# EAGLE design meca_2018 (EAGLE 7.7.0)

## Sheet 1 of 4
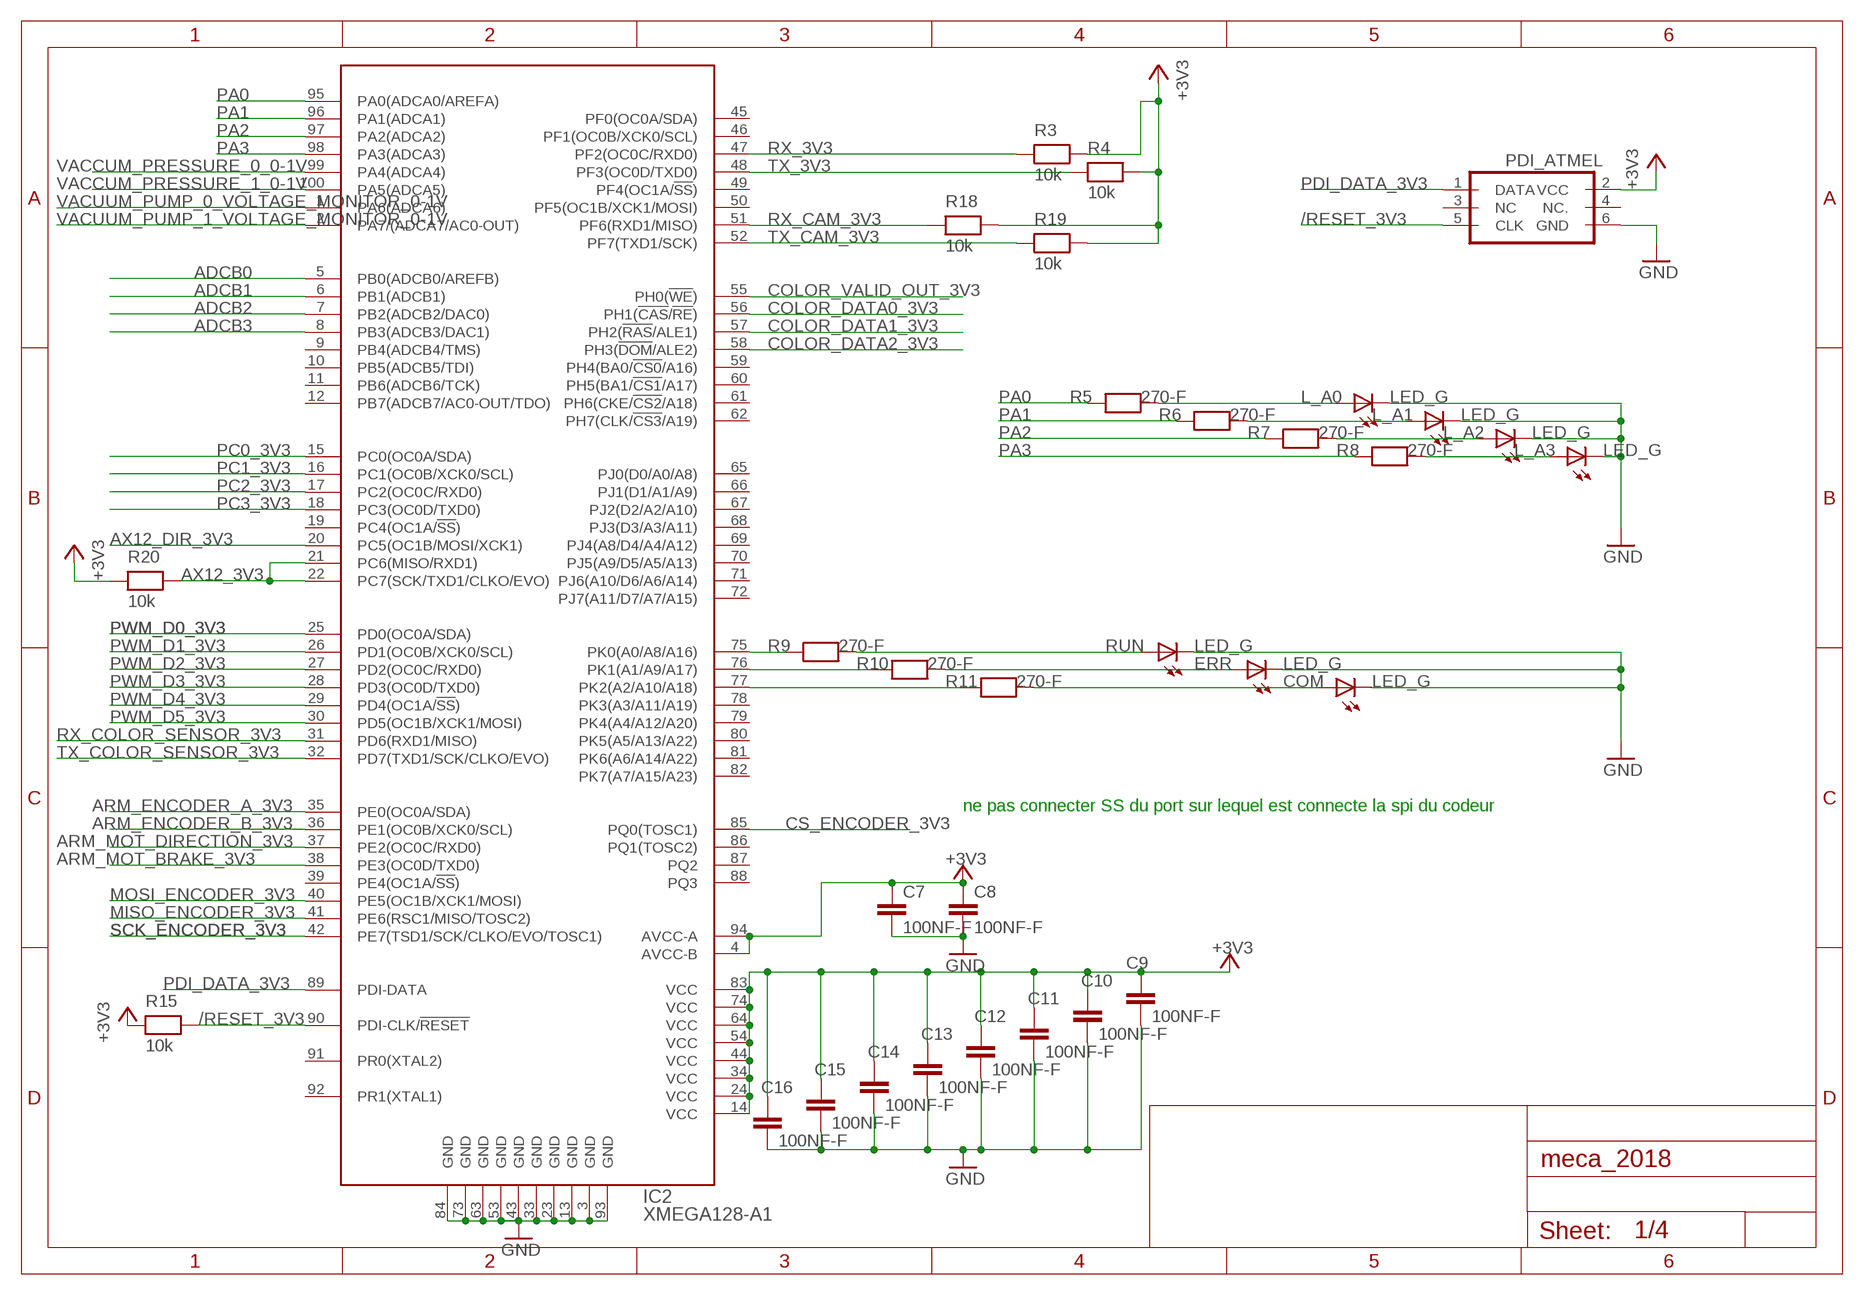
[diagram p0: schematic, sheet 1]

### Parts
C7  100NF-F  [C0603]
C8  100NF-F  [C0603]
C9  100NF-F  [C0603]
C10  100NF-F  [C0603]
C11  100NF-F  [C0603]
C12  100NF-F  [C0603]
C13  100NF-F  [C0603]
C14  100NF-F  [C0603]
C15  100NF-F  [C0603]
C16  100NF-F  [C0603]
COM  LED_G  [CHIP-LED0805]
ERR  LED_G  [CHIP-LED0805]
IC2  XMEGA128-A1  XMEGA-A1TQFP  [TQFP100]
L_A0  LED_G  [CHIP-LED0805]
L_A1  LED_G  [CHIP-LED0805]
L_A2  LED_G  [CHIP-LED0805]
L_A3  LED_G  [CHIP-LED0805]
PDI_ATMEL  PDI_ATMEL  [ML6]
R3  10k  10K-F  [R0603]
R4  10k  10K-F  [R0603]
R5  270-F  [R0603]
R6  270-F  [R0603]
R7  270-F  [R0603]
R8  270-F  [R0603]
R9  270-F  [R0603]
R10  270-F  [R0603]
R11  270-F  [R0603]
R15  10k  10K-F  [R0603]
R18  10k  10K-F  [R0603]
R19  10k  10K-F  [R0603]
R20  10k  10K-F  [R0603]
RUN  LED_G  [CHIP-LED0805]

### Nets
+3V3: C7.1 C8.1 C9.1 C10.1 C11.1 C12.1 C13.1 C14.1 C15.1 C16.1 IC2.4(AVCC-B) IC2.14(VCC) IC2.24(VCC) IC2.34(VCC) IC2.44(VCC) IC2.54(VCC) IC2.64(VCC) IC2.74(VCC) IC2.83(VCC) IC2.94(AVCC-A) PDI_ATMEL.2(VCC) R3.2 R4.2 R15.1 R18.2 R19.2 R20.1 ; also sheet 2,3,4
/RESET_3V3: IC2.90(PDI-CLK/!RESET) PDI_ATMEL.5(CLK) R15.2
ADCB0: IC2.5(PB0(ADCB0/AREFB))
ADCB1: IC2.6(PB1(ADCB1))
ADCB2: IC2.7(PB2(ADCB2/DAC0))
ADCB3: IC2.8(PB3(ADCB3/DAC1))
ARM_ENCODER_A_3V3: IC2.35(PE0(OC0A/SDA))
ARM_ENCODER_B_3V3: IC2.36(PE1(OC0B/XCK0/SCL))
ARM_MOT_BRAKE_3V3: IC2.38(PE3(OC0D/TXD0))
ARM_MOT_DIRECTION_3V3: IC2.37(PE2(OC0C/RXD0))
AX12_3V3: IC2.21(PC6(MISO/RXD1)) IC2.22(PC7(SCK/TXD1/CLKO/EVO)) R20.2 ; also sheet 2
AX12_DIR_3V3: IC2.20(PC5(OC1B/MOSI/XCK1)) ; also sheet 2
COLOR_DATA0_3V3: IC2.56(PH1(!CAS!/!RE!))
COLOR_DATA1_3V3: IC2.57(PH2(!RAS!/ALE1))
COLOR_DATA2_3V3: IC2.58(PH3(!DOM!/ALE2))
COLOR_VALID_OUT_3V3: IC2.55(PH0(!WE!))
CS_ENCODER_3V3: IC2.85(PQ0(TOSC1))
GND: C7.2 C8.2 C9.2 C10.2 C11.2 C12.2 C13.2 C14.2 C15.2 C16.2 COM.C ERR.C IC2.3(GND) IC2.13(GND) IC2.23(GND) IC2.33(GND) IC2.43(GND) IC2.53(GND) IC2.63(GND) IC2.73(GND) IC2.84(GND) IC2.93(GND) L_A0.C L_A1.C L_A2.C L_A3.C PDI_ATMEL.6(GND) RUN.C ; also sheet 2,3,4
MISO_ENCODER_3V3: IC2.41(PE6(RSC1/MISO/TOSC2)) ; also sheet 2
MOSI_ENCODER_3V3: IC2.40(PE5(OC1B/XCK1/MOSI))
N$2: R9.2 RUN.A
N$4: ERR.A R10.2
N$7: COM.A R11.2
N$9: IC2.75(PK0(A0/A8/A16)) R9.1
N$10: IC2.76(PK1(A1/A9/A17)) R10.1
N$12: IC2.77(PK2(A2/A10/A18)) R11.1
N$91: L_A0.A R5.2
N$92: L_A1.A R6.2
N$93: L_A2.A R7.2
N$94: L_A3.A R8.2
PA0: IC2.95(PA0(ADCA0/AREFA)) R5.1
PA1: IC2.96(PA1(ADCA1)) R6.1
PA2: IC2.97(PA2(ADCA2)) R7.1
PA3: IC2.98(PA3(ADCA3)) R8.1
PC0_3V3: IC2.15(PC0(OC0A/SDA))
PC1_3V3: IC2.16(PC1(OC0B/XCK0/SCL))
PC2_3V3: IC2.17(PC2(OC0C/RXD0))
PC3_3V3: IC2.18(PC3(OC0D/TXD0))
PDI_DATA_3V3: IC2.89(PDI-DATA) PDI_ATMEL.1(DATA)
PWM_D0_3V3: IC2.25(PD0(OC0A/SDA)) ; also sheet 2
PWM_D1_3V3: IC2.26(PD1(OC0B/XCK0/SCL)) ; also sheet 2
PWM_D2_3V3: IC2.27(PD2(OC0C/RXD0)) ; also sheet 2
PWM_D3_3V3: IC2.28(PD3(OC0D/TXD0)) ; also sheet 2
PWM_D4_3V3: IC2.29(PD4(OC1A/!SS!)) ; also sheet 2
PWM_D5_3V3: IC2.30(PD5(OC1B/XCK1/MOSI)) ; also sheet 2
RX_3V3: IC2.47(PF2(OC0C/RXD0)) R3.1 ; also sheet 3
RX_CAM_3V3: IC2.51(PF6(RXD1/MISO)) R18.1 ; also sheet 2
RX_COLOR_SENSOR_3V3: IC2.31(PD6(RXD1/MISO))
SCK_ENCODER_3V3: IC2.42(PE7(TSD1/SCK/CLKO/EVO/TOSC1))
TX_3V3: IC2.48(PF3(OC0D/TXD0)) R4.1 ; also sheet 3
TX_CAM_3V3: IC2.52(PF7(TXD1/SCK)) R19.1 ; also sheet 2
TX_COLOR_SENSOR_3V3: IC2.32(PD7(TXD1/SCK/CLKO/EVO))
VACCUM_PRESSURE_0_0-1V: IC2.99(PA4(ADCA4))
VACCUM_PRESSURE_1_0-1V: IC2.100(PA5(ADCA5))
VACUUM_PUMP_0_VOLTAGE_MONITOR_0-1V: IC2.1(PA6(ADCA6))
VACUUM_PUMP_1_VOLTAGE_MONITOR_0-1V: IC2.2(PA7/(ADCA7/AC0-OUT))
Unconnected: IC2.9(PB4(ADCB4/TMS)) IC2.10(PB5(ADCB5/TDI)) IC2.11(PB6(ADCB6/TCK)) IC2.12(PB7(ADCB7/AC0-OUT/TDO)) IC2.19(PC4(OC1A/!SS!)) IC2.39(PE4(OC1A/!SS!)) IC2.45(PF0(OC0A/SDA)) IC2.46(PF1(OC0B/XCK0/SCL)) IC2.49(PF4(OC1A/!SS!)) IC2.50(PF5(OC1B/XCK1/MOSI)) IC2.59(PH4(BA0/!CS0!/A16)) IC2.60(PH5(BA1/!CS1!/A17)) IC2.61(PH6(CKE/!CS2!/A18)) IC2.62(PH7(CLK/!CS3!/A19)) IC2.65(PJ0(D0/A0/A8)) IC2.66(PJ1(D1/A1/A9)) IC2.67(PJ2(D2/A2/A10)) IC2.68(PJ3(D3/A3/A11)) IC2.69(PJ4(A8/D4/A4/A12)) IC2.70(PJ5(A9/D5/A5/A13)) IC2.71(PJ6(A10/D6/A6/A14)) IC2.72(PJ7(A11/D7/A7/A15)) IC2.78(PK3(A3/A11/A19)) IC2.79(PK4(A4/A12/A20)) IC2.80(PK5(A5/A13/A22)) IC2.81(PK6(A6/A14/A22)) IC2.82(PK7(A7/A15/A23)) IC2.86(PQ1(TOSC2)) IC2.87(PQ2) IC2.88(PQ3) IC2.91(PR0(XTAL2)) IC2.92(PR1(XTAL1)) PDI_ATMEL.3(NC) PDI_ATMEL.4(NC.)

### Notes on the sheet
- ne pas connecter SS du port sur lequel est connecte la spi du codeur

## Sheet 2 of 4
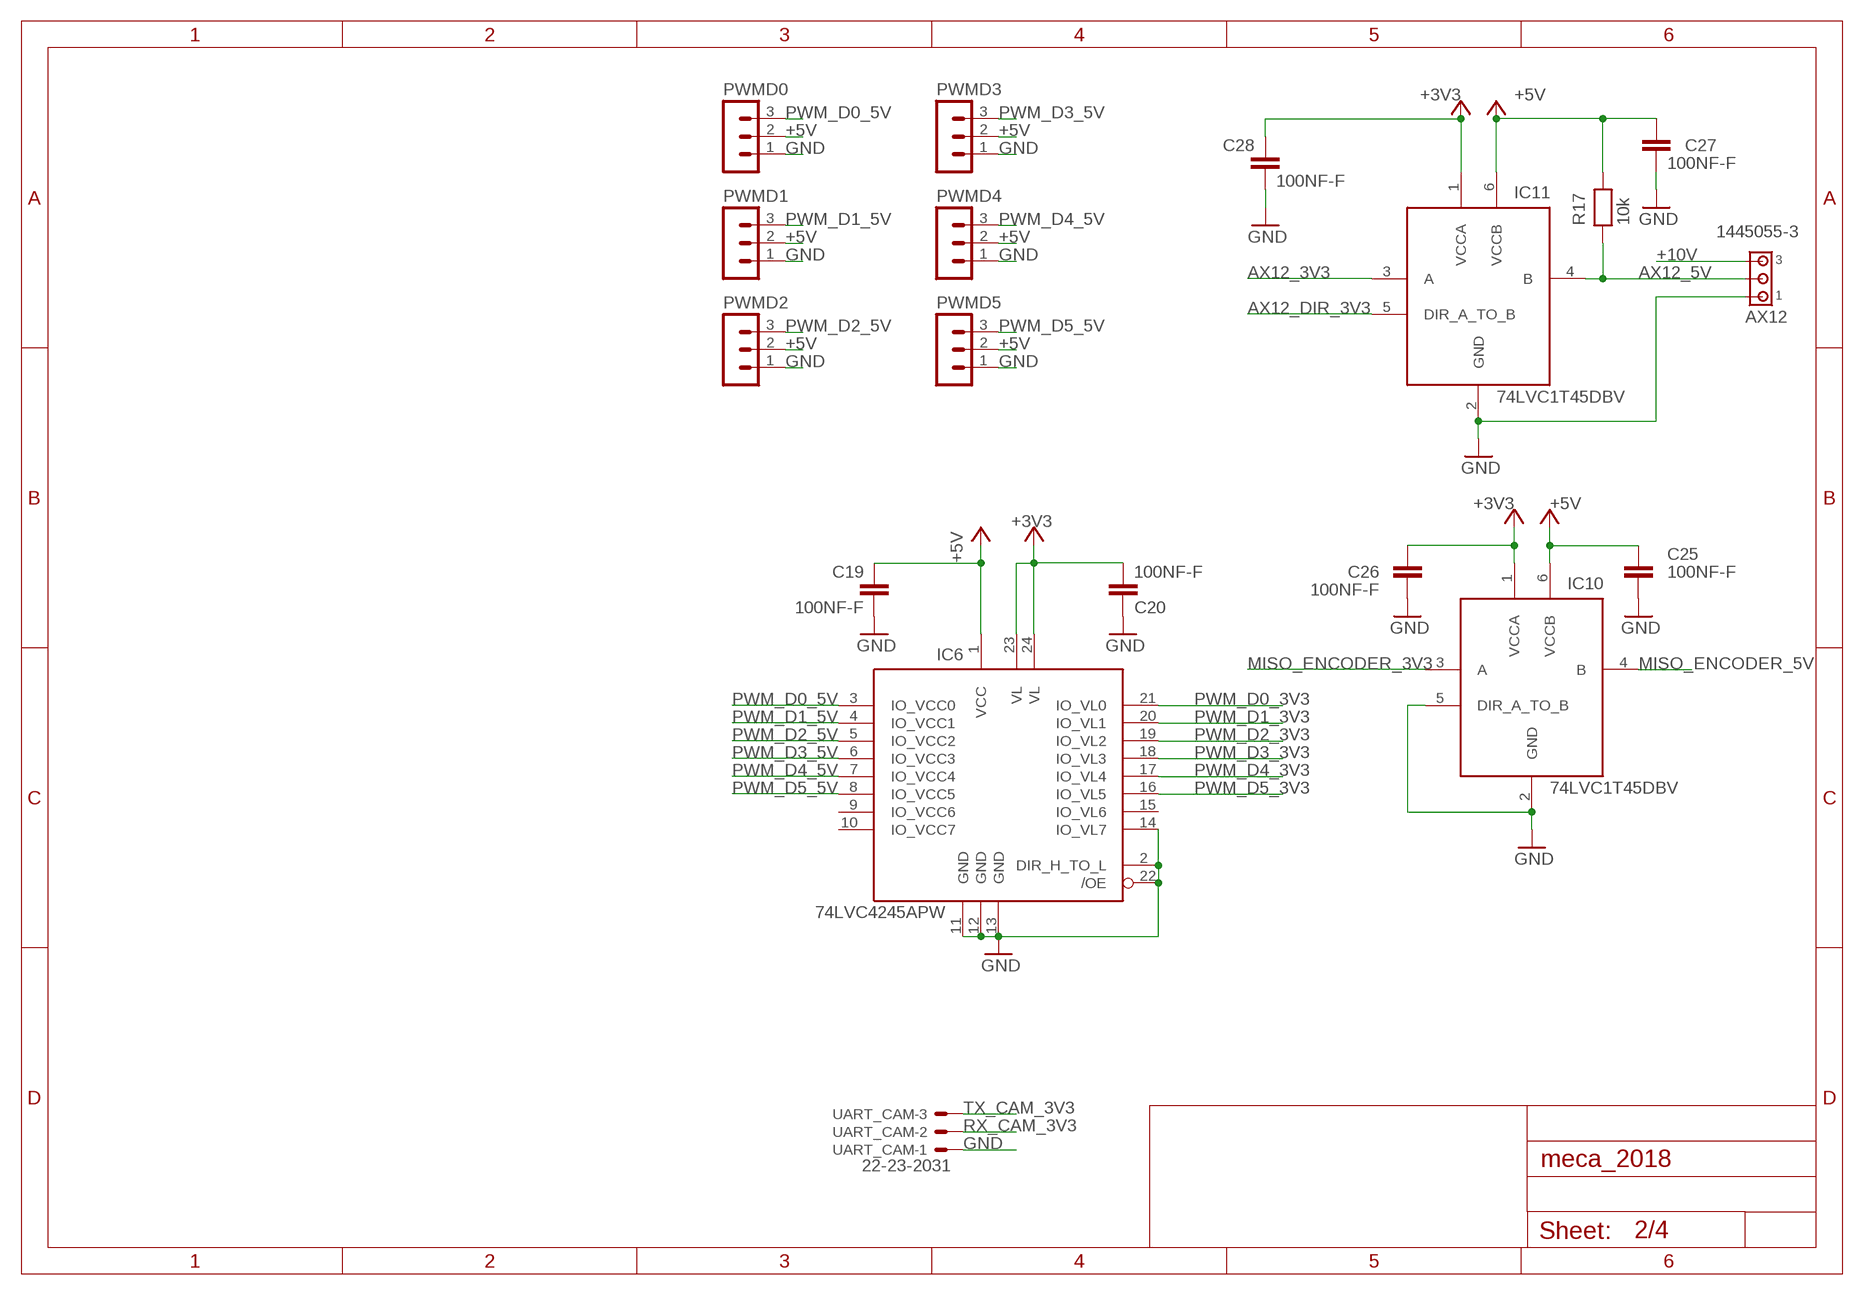
[diagram p1: schematic, sheet 2]

### Parts
AX12  1445055-3  [1445055-3]
C19  100NF-F  [C0603]
C20  100NF-F  [C0603]
C25  100NF-F  [C0603]
C26  100NF-F  [C0603]
C27  100NF-F  [C0603]
C28  100NF-F  [C0603]
IC6  74LVC4245APW  [TSSOP24]
IC10  74LVC1T45DBV  [SOT23-6]
IC11  74LVC1T45DBV  [SOT23-6]
PWMD0  MA03-1  [MA03-1]
PWMD1  MA03-1  [MA03-1]
PWMD2  MA03-1  [MA03-1]
PWMD3  MA03-1  [MA03-1]
PWMD4  MA03-1  [MA03-1]
PWMD5  MA03-1  [MA03-1]
R17  10k  10K-F  [R0603]
UART_CAM  22-23-2031  [22-23-2031]

### Nets
+3V3: C20.1 C26.1 C28.1 IC6.23(VL) IC6.24(VL) IC10.1(VCCA) IC11.1(VCCA) ; also sheet 1,3,4
+5V: C19.1 C25.1 C27.1 IC6.1(VCC) IC10.6(VCCB) IC11.6(VCCB) PWMD0.2 PWMD1.2 PWMD2.2 PWMD3.2 PWMD4.2 PWMD5.2 R17.2 ; also sheet 4
+10V: AX12.3 ; also sheet 4
AX12_3V3: IC11.3(A) ; also sheet 1
AX12_5V: AX12.2 IC11.4(B) R17.1
AX12_DIR_3V3: IC11.5(DIR_A_TO_B) ; also sheet 1
GND: AX12.1 C19.2 C20.2 C25.2 C26.2 C27.2 C28.2 IC6.2(DIR_H_TO_L) IC6.11(GND) IC6.12(GND) IC6.13(GND) IC6.14(IO_VL7) IC6.22(/OE) IC10.2(GND) IC10.5(DIR_A_TO_B) IC11.2(GND) PWMD0.1 PWMD1.1 PWMD2.1 PWMD3.1 PWMD4.1 PWMD5.1 UART_CAM.1 ; also sheet 1,3,4
MISO_ENCODER_3V3: IC10.3(A) ; also sheet 1
MISO_ENCODER_5V: IC10.4(B)
PWM_D0_3V3: IC6.21(IO_VL0) ; also sheet 1
PWM_D0_5V: IC6.3(IO_VCC0) PWMD0.3
PWM_D1_3V3: IC6.20(IO_VL1) ; also sheet 1
PWM_D1_5V: IC6.4(IO_VCC1) PWMD1.3
PWM_D2_3V3: IC6.19(IO_VL2) ; also sheet 1
PWM_D2_5V: IC6.5(IO_VCC2) PWMD2.3
PWM_D3_3V3: IC6.18(IO_VL3) ; also sheet 1
PWM_D3_5V: IC6.6(IO_VCC3) PWMD3.3
PWM_D4_3V3: IC6.17(IO_VL4) ; also sheet 1
PWM_D4_5V: IC6.7(IO_VCC4) PWMD4.3
PWM_D5_3V3: IC6.16(IO_VL5) ; also sheet 1
PWM_D5_5V: IC6.8(IO_VCC5) PWMD5.3
RX_CAM_3V3: UART_CAM.2 ; also sheet 1
TX_CAM_3V3: UART_CAM.3 ; also sheet 1
Unconnected: IC6.9(IO_VCC6) IC6.10(IO_VCC7) IC6.15(IO_VL6)

## Sheet 3 of 4
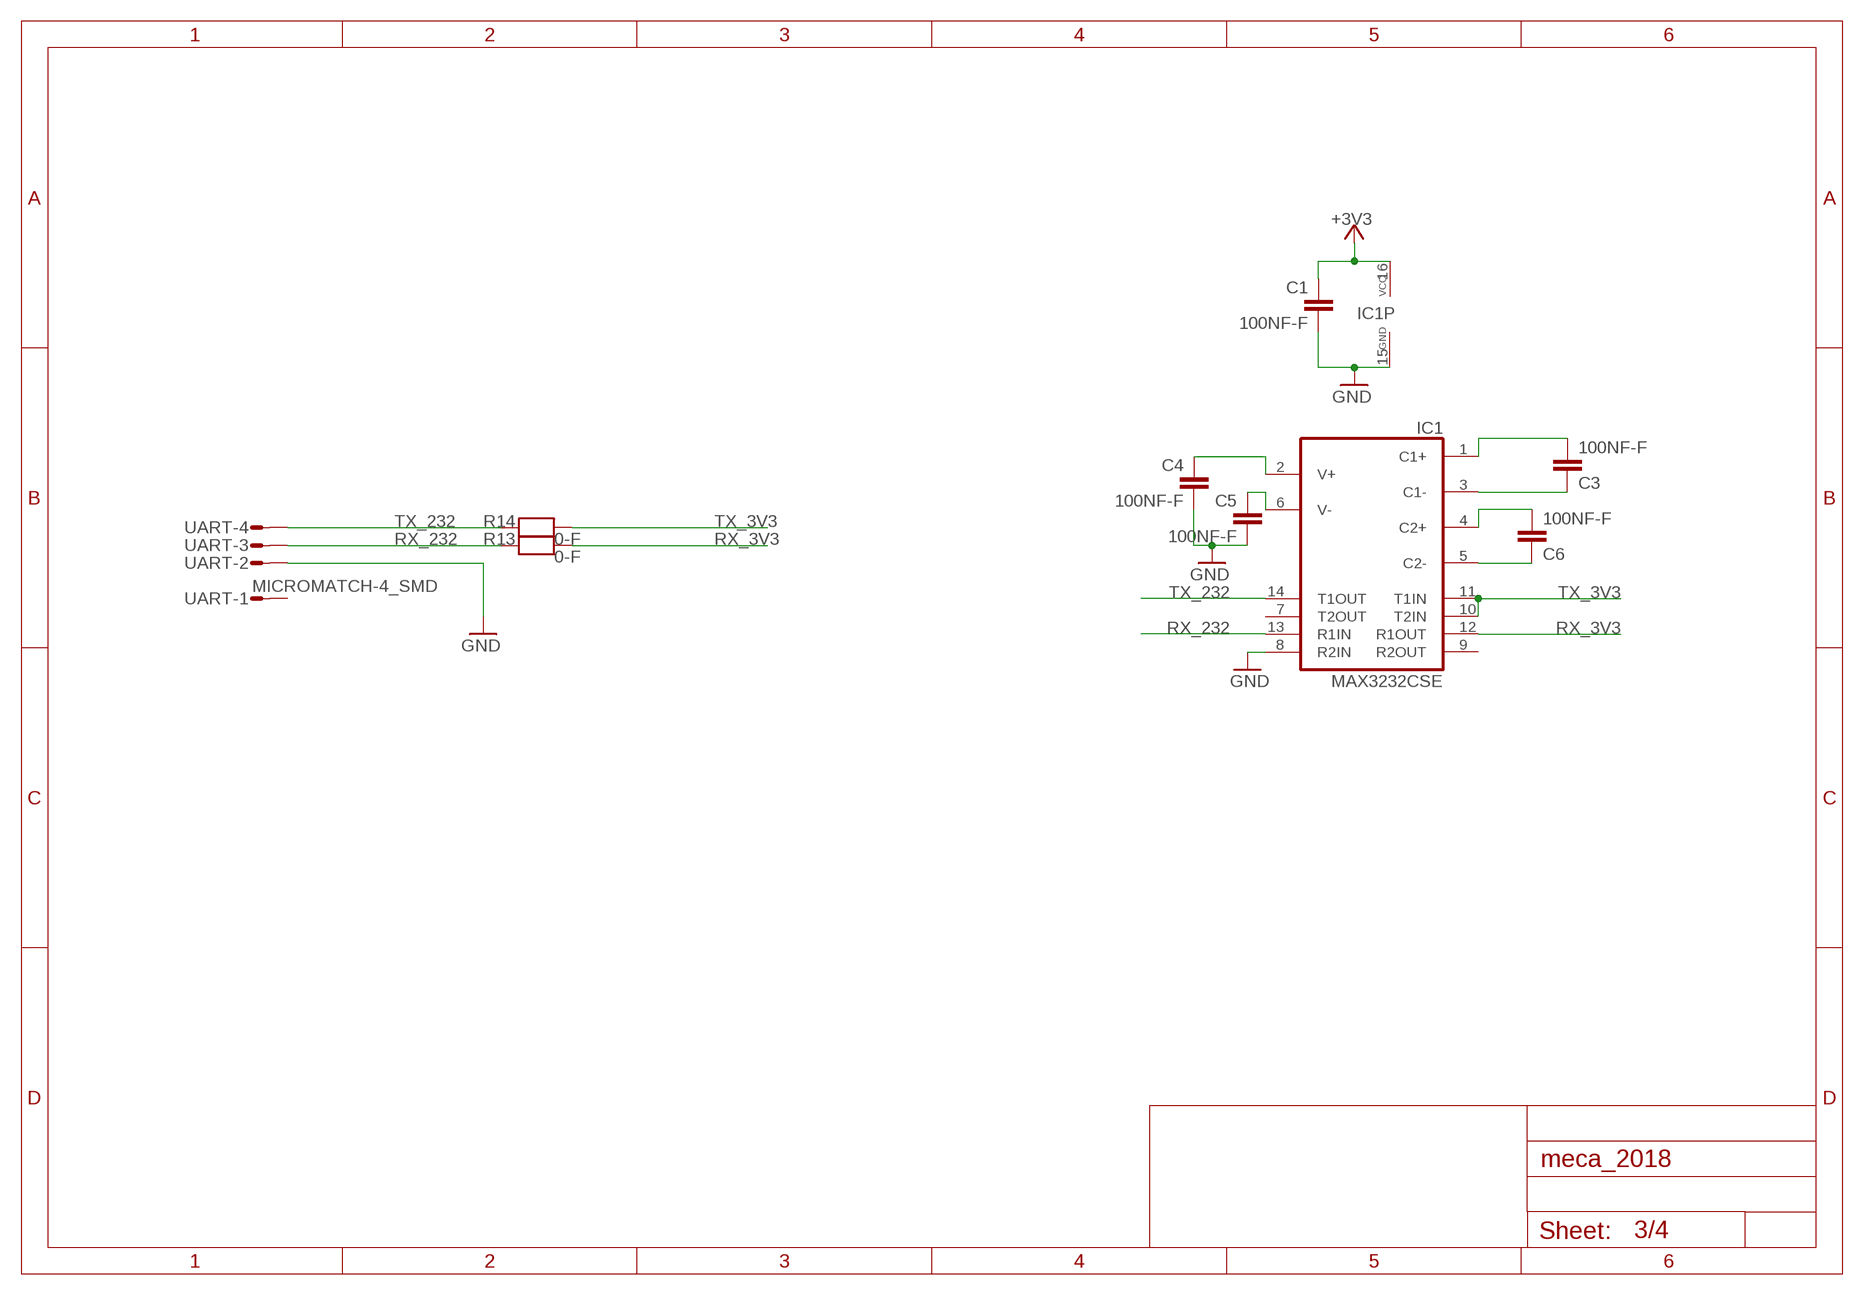
[diagram p2: schematic, sheet 3]

### Parts
C1  100NF-F  [C0603]
C3  100NF-F  [C0603]
C4  100NF-F  [C0603]
C5  100NF-F  [C0603]
C6  100NF-F  [C0603]
IC1  MAX3232CSE  [SO16]
R13  0-F  [R0603]
R14  0-F  [R0603]
UART  MICROMATCH-4_SMD  [MICROMATCH-4_SMD]

### Nets
+3V3: C1.1 IC1.16(VCC) ; also sheet 1,2,4
GND: C1.2 C4.2 C5.2 IC1.8(R2IN) IC1.15(GND) UART.2 ; also sheet 1,2,4
N$1: C3.1 IC1.1(C1+)
N$5: C3.2 IC1.3(C1-)
N$6: C6.1 IC1.4(C2+)
N$11: C4.1 IC1.2(V+)
N$13: C5.1 IC1.6(V-)
N$24: C6.2 IC1.5(C2-)
RX_3V3: IC1.12(R1OUT) R13.2 ; also sheet 1
RX_232: IC1.13(R1IN) R13.1 UART.3
TX_3V3: IC1.10(T2IN) IC1.11(T1IN) R14.2 ; also sheet 1
TX_232: IC1.14(T1OUT) R14.1 UART.4
Unconnected: IC1.7(T2OUT) IC1.9(R2OUT) UART.1

## Sheet 4 of 4
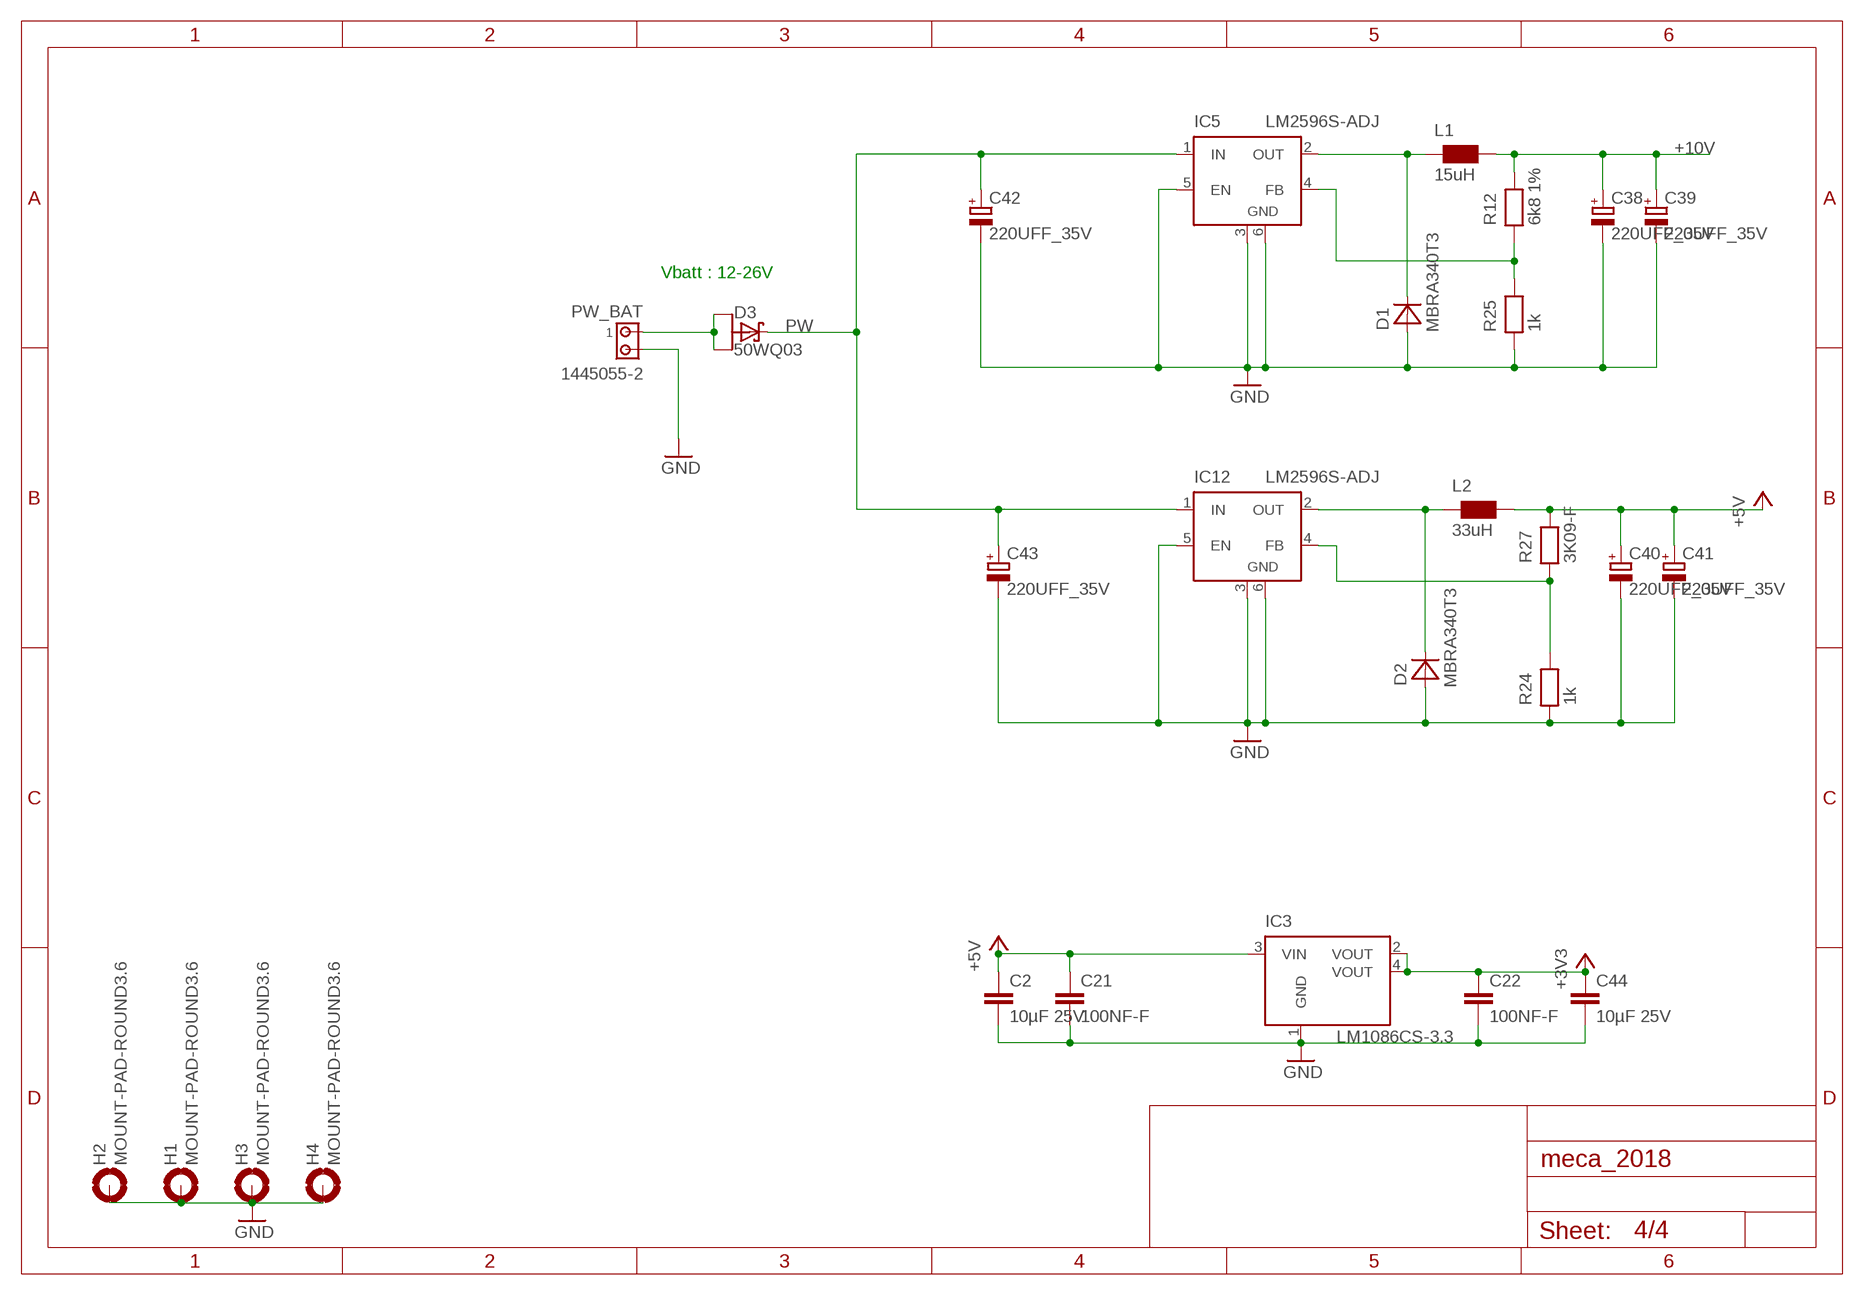
[diagram p3: schematic, sheet 4]

### Parts
C2  10µF 25V  10UF-C_25V  [C1210]
C21  100NF-F  [C0603]
C22  100NF-F  [C0603]
C38  220UFF_35V  [PANASONIC_F]
C39  220UFF_35V  [PANASONIC_F]
C40  220UFF_35V  [PANASONIC_F]
C41  220UFF_35V  [PANASONIC_F]
C42  220UFF_35V  [PANASONIC_F]
C43  220UFF_35V  [PANASONIC_F]
C44  10µF 25V  10UF-C_25V  [C1210]
D1  MBRA340T3  [SMA]
D2  MBRA340T3  [SMA]
D3  50WQ03  [TO252]
H1  MOUNT-PAD-ROUND3.6  [3,6-PAD]
H2  MOUNT-PAD-ROUND3.6  [3,6-PAD]
H3  MOUNT-PAD-ROUND3.6  [3,6-PAD]
H4  MOUNT-PAD-ROUND3.6  [3,6-PAD]
IC3  LM1086CS-3.3  [TO263]
IC5  LM2596S-ADJ  [TO263-5]
IC12  LM2596S-ADJ  [TO263-5]
L1  15uH  SRR1280-150  [SRR1280]
L2  33uH  33µH-3.3A  [SRR1280]
PW_BAT  1445055-2  [1445055-2]
R12  6k8 1%  6K8-F  [R0603]
R24  1k  1K-F  [R0603]
R25  1k  1K-F  [R0603]
R27  3K09-F  [R0603]

### Nets
+3V3: C22.1 C44.1 IC3.2(VOUT) IC3.4(VOUT) ; also sheet 1,2,3
+5V: C2.1 C21.1 C40.+ C41.+ IC3.3(VIN) L2.2 R27.2 ; also sheet 2
+10V: C38.+ C39.+ L1.2 R12.2 ; also sheet 2
GND: C2.2 C21.2 C22.2 C38.- C39.- C40.- C41.- C42.- C43.- C44.2 D1.A D2.A H1.B3,6(MOUNT) H2.B3,6(MOUNT) H3.B3,6(MOUNT) H4.B3,6(MOUNT) IC3.1(GND) IC5.3(GND) IC5.5(EN) IC5.6(GND) IC12.3(GND) IC12.5(EN) IC12.6(GND) PW_BAT.2 R24.1 R25.1 ; also sheet 1,2,3
N$3: IC12.4(FB) R24.2 R27.1
N$8: IC5.4(FB) R12.1 R25.2
N$14: D3.1(A1) D3.3(A2) PW_BAT.1
N$16: D1.C IC5.2(OUT) L1.1
N$17: D2.C IC12.2(OUT) L2.1
PW: C42.+ C43.+ D3.4(C) IC5.1(IN) IC12.1(IN)

### Notes on the sheet
- Vbatt : 12-26V

## Library data of the parts
AX12 = robotter_connector:1445055-3: Micro MATE-N-LOK Connectors grid 1.5 mm Source: ENG_CD_1445055_A.pdf; FARNELL: 1111119; MOUSER: 571-2-1445055-3; RS: 495-9596
C1 C3-C16 C19-C22 C25-C28 = robotter_capacitor:100NF; MOUSER: 81-GRM188F51H104ZA01; RS: 723-5534; VALUE: 100nF 50V
C2 C44 = robotter_capacitor:10UF; MOUSER: 963-TMK316BJ106KL-T; RS: 766-1185
C38-C43 = robotter_capacitor:220UF; MOUSER: 667-EEE-FP1V221AP; RS: 568-828; VALUE: 220µF 35V
COM ERR L_A0 L_A1-L_A3 RUN = robotter_diode:LED_; MOUSER: 859-LTST-C171GKT; RS: 692-0935; VALUE: GREEN
D1 D2 = robotter_diode:MBRA340T3: Surface Mount Schottky Power Rectifier Source: http://www.onsemi.com/pub_link/Collateral/MBRA340T3-D.PDF; MOUSER: 863-MBRA340T3G; RS: 688-0502
D3 = robotter_diode:50WQ03; MOUSER: 844-50WQ03FNPBF; RS: 302-167
H1-H4 = holes:MOUNT-PAD-ROUND: MOUNTING PAD, round
IC1 = robotter_ic:MAX3232: True RS-232 Transceivers 3.0V to 5.5V, Low-Power up to 1Mbps, Using Four 0.1µF External Capacitors Source: http://pdfserv.maxim-ic.com/en/ds/MAX3222-MAX3241.pdf; MOUSER: 511-ST3232CDR; RS: 415-2105
IC2 = avr-7:XMEGA-A1: Atmel XMega A1 Series processor
IC3 = robotter_ic:LM1086CS-3.3; MOUSER: 926-LM1086CS-3.3NOPB; RS: 533-9426
IC5 IC12 = robotter_ic:LM2596S: STEP-DOWN VOLTAGE REGULATOR; FARNELL: 1469194; MOUSER: 926-LM2596SX-ADJNOPB; RS: 533-3715
IC6 = robotter_ic:74LVC4245: octal transceiver buffer; MOUSER: 771-74LVC4245APW-T; RS: 380-0500
IC10 IC11 = robotter_ic:74LVC1T45; MOUSER: 595-SN74LVC1T45DBVT; RS: 662-8825
L1 = robotter_inductor:SRR1280; MOUSER: 652-SRR1280-150M; RS: 693-4643; VALUE: 15µH 5.2A
L2 = robotter_inductor:33µH; MOUSER: 652-SRR1280-330M; RS: 727-2274; VALUE: 33µH
PDI_ATMEL = robotter_connector:PDI_ATMEL: Ref Harting : 09 18 506 7323 Atmel pdi connector; MOUSER: 617-09185066323
PW_BAT = robotter_connector:1445055-2: Micro MATE-N-LOK Connectors grid 1.5 mm Source: ENG_CD_1445055_A.pdf; MOUSER: 571-2-1445055-2; RS: 495-9580
PWMD0 PWMD1-PWMD5 = con-lstb:MA03-1: PIN HEADER; OC_FARNELL: unknown; OC_NEWARK: unknown
R3 R4 R15 R17-R20 = robotter_resistor:10K; MOUSER: 652-CR0603-JW-103ELF; RS: 740-8899
R5-R11 = robotter_resistor:270; MOUSER: 71-CRCW0603J-270-E3; RS: 679-0071
R12 = robotter_resistor:6K8; MOUSER: 652-CR0603-JW-682GLF; RS: 740-8969; VALUE: 6k8
R13 R14 = robotter_resistor:0
R24 R25 = robotter_resistor:1K; MOUSER: 71-CRCW0603-1.0K-E3; RS: 213-2266
R27 = robotter_resistor:3K09; MOUSER: 667-ERA-3AEB3091V; RS: 708-7574
UART = robotter_connector:MICROMATCH-4_SMD: Ref FN : 1865094; MOUSER: 571-7-188275-4; RS: 366-1721
UART_CAM = robotter_connector:22-23-2031: .100" (2.54mm) Center Header - 3 Pin; FARNELL: 1462950; MF: MOLEX; MOUSER: 538-22-23-2031; MPN: 22-23-2031; RS: 679-5587

## Board
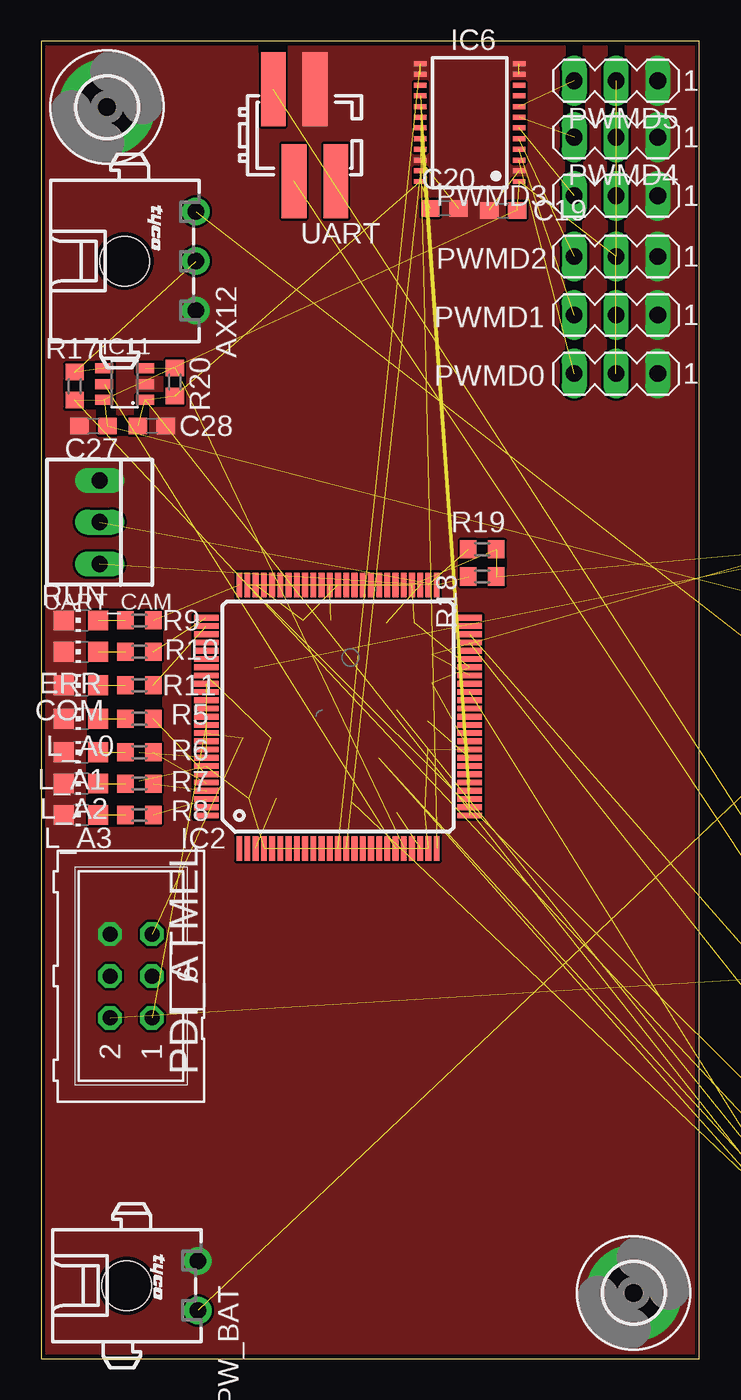
[diagram p4: board, top side]
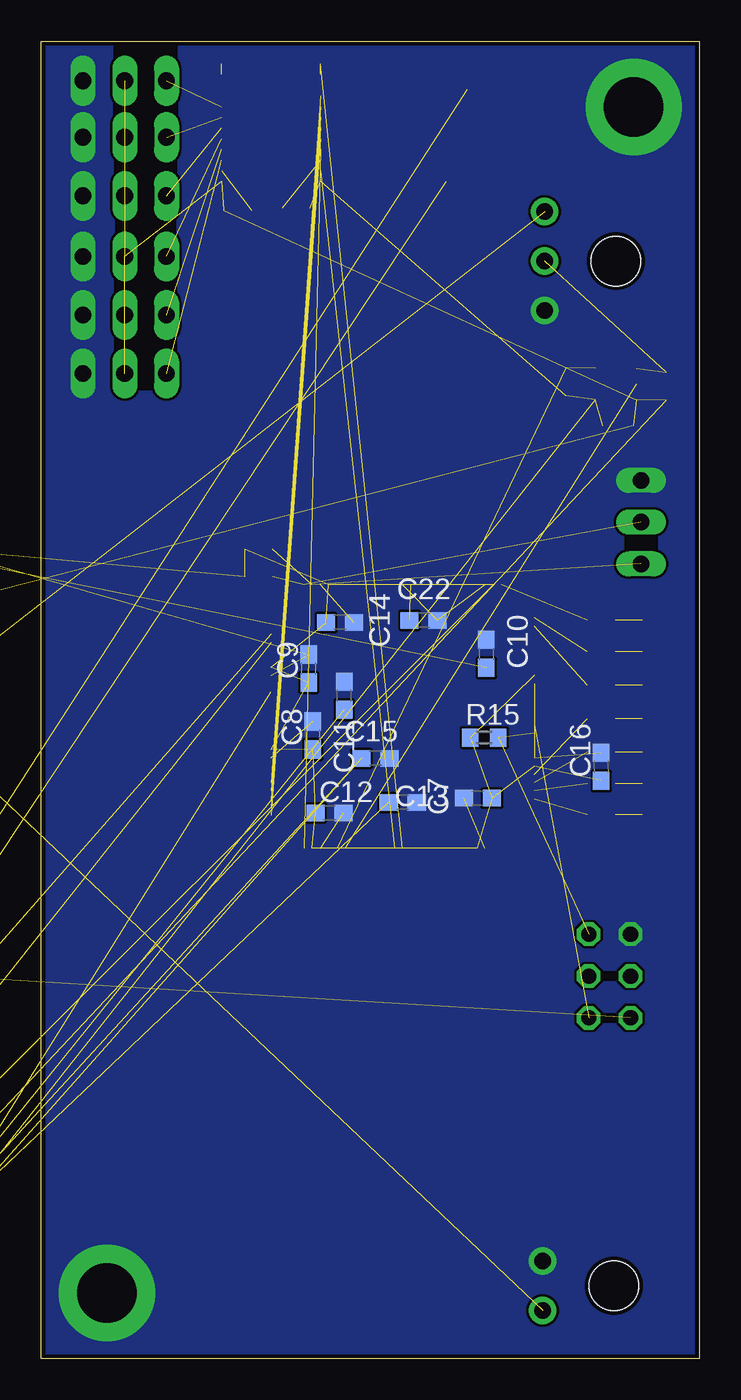
[diagram p5: board, bottom side, seen from below]

Size 40 x 80 mm. Coordinates in mm from the lower left corner, seen from the top.
Outline: 0,0 40,0 40,80 0,80 0,0
Copper layers (1*16): Top 0.035mm / dielectric 1.5mm / Bottom 0.035mm
Design rules "default": minimum track width 6mil, minimum drill 12mil, track to track 6mil, track to pad 6mil, pad to pad 6mil, via to via 6mil, smd to smd 0mil, copper to edge 10mil, drill to drill 10mil, minimum pad ring 10mil, minimum via ring 6mil, stop-mask expansion 2mil, vias tented up to drill 100mil, thermal gap 10mil

### Footprints (pad centres in the part's own frame; a part is rotated, then mirrored left to right if it is on the bottom)
1445055-3 = drill 1 pad 1.676: 1 3,4.32; 2 0,4.32; 3 -3,4.32 | hole 3: 0,0
C0603 = smd 1.1 x 1: 1 -0.85,0; 2 0.85,0
C1210 = smd 1.6 x 2.7: 1 -1.4,0; 2 1.4,0
PANASONIC_F = smd 4 x 1.6: + 3.55,0; - -3.55,0
CHIP-LED0805 = smd 1.2 x 1.2: A 0,-1.05; C 0,1.05
SMA = smd 2 x 2: A 2,0; C -2,0
TO252 = smd 1 x 1.6: 1 -2.28,-4.8; 3 2.28,-4.8 | smd 5.4 x 6.2: 4 0,2.5
3,6-PAD = drill 3.6 pad 5.842: B3,6 0,0
SO16 = smd 0.66 x 2.032: 1 -4.445,-3.073; 2 -3.175,-3.073; 3 -1.905,-3.073; 4 -0.635,-3.073; 5 0.635,-3.073; 6 1.905,-3.073; 7 3.175,-3.073; 8 4.445,-3.073; 9 4.445,3.073; 10 3.175,3.073; 11 1.905,3.073; 12 0.635,3.073; 13 -0.635,3.073; 14 -1.905,3.073; 15 -3.175,3.073; 16 -4.445,3.073
TQFP100 = smd 1.5 x 0.347: 1 -8,6; 2 -8,5.5; 3 -8,5; 4 -8,4.5; 5 -8,4; 6 -8,3.5; 7 -8,3; 8 -8,2.5; 9 -8,2; 10 -8,1.5; 11 -8,1; 12 -8,0.5; 13 -8,0; 14 -8,-0.5; 15 -8,-1; 16 -8,-1.5; 17 -8,-2; 18 -8,-2.5; 19 -8,-3; 20 -8,-3.5; 21 -8,-4; 22 -8,-4.5; 23 -8,-5; 24 -8,-5.5; 25 -8,-6; 51 8,-6; 52 8,-5.5; 53 8,-5; 54 8,-4.5; 55 8,-4; 56 8,-3.5; 57 8,-3; 58 8,-2.5; 59 8,-2; 60 8,-1.5; 61 8,-1; 62 8,-0.5; 63 8,0; 64 8,0.5; 65 8,1; 66 8,1.5; 67 8,2; 68 8,2.5; 69 8,3; 70 8,3.5; 71 8,4; 72 8,4.5; 73 8,5; 74 8,5.5; 75 8,6 | smd 0.347 x 1.5: 26 -6,-8; 27 -5.5,-8; 28 -5,-8; 29 -4.5,-8; 30 -4,-8; 31 -3.5,-8; 32 -3,-8; 33 -2.5,-8; 34 -2,-8; 35 -1.5,-8; 36 -1,-8; 37 -0.5,-8; 38 0,-8; 39 0.5,-8; 40 1,-8; 41 1.5,-8; 42 2,-8; 43 2.5,-8; 44 3,-8; 45 3.5,-8; 46 4,-8; 47 4.5,-8; 48 5,-8; 49 5.5,-8; 50 6,-8; 76 6,8; 77 5.5,8; 78 5,8; 79 4.5,8; 80 4,8; 81 3.5,8; 82 3,8; 83 2.5,8; 84 2,8; 85 1.5,8; 86 1,8; 87 0.5,8; 88 0,8; 89 -0.5,8; 90 -1,8; 91 -1.5,8; 92 -2,8; 93 -2.5,8; 94 -3,8; 95 -3.5,8; 96 -4,8; 97 -4.5,8; 98 -5,8; 99 -5.5,8; 100 -6,8
TO263 = smd 1.1 x 2.5: 1 -2.54,-8.15; 2 0,-8.15; 3 2.54,-8.15 | smd 10.8 x 9: 4 0,1.85
TO263-5 = smd 1.067 x 2.159: 1 -3.404,-5.791; 2 -1.702,-5.791; 3 0,-5.791; 4 1.702,-5.791; 5 3.404,-5.791 | smd 10.8 x 10.41: 6 0,2.54
TSSOP24 = smd 0.3 x 0.75: 1 -3.575,-3; 2 -2.925,-3; 3 -2.275,-3; 4 -1.625,-3; 5 -0.975,-3; 6 -0.325,-3; 7 0.325,-3; 8 0.975,-3; 9 1.625,-3; 10 2.275,-3; 11 2.925,-3; 12 3.575,-3; 13 3.575,3; 14 2.925,3; 15 2.275,3; 16 1.625,3; 17 0.975,3; 18 0.325,3; 19 -0.325,3; 20 -0.975,3; 21 -1.625,3; 22 -2.275,3; 23 -2.925,3; 24 -3.575,3
SOT23-6 = smd 0.6 x 1.1: 1 -0.95,-1.25; 2 0,-1.25; 3 0.95,-1.25; 4 0.95,1.25; 5 0,1.25; 6 -0.95,1.25
SRR1280 = smd 3.4 x 5.4: 1 -5.1,0; 2 5.1,0
ML6 = drill 0.914 octagon: 1 -2.54,-1.27; 2 -2.54,1.27; 3 0,-1.27; 4 0,1.27; 5 2.54,-1.27; 6 2.54,1.27
1445055-2 = drill 1 pad 1.676: 1 1.5,4.32; 2 -1.5,4.32 | hole 3: 0,0
MA03-1 = drill 1.016 long: 1 -2.54,0; 2 0,0; 3 2.54,0
R0603 = smd 1 x 1.1: 1 -0.85,0; 2 0.85,0
MICROMATCH-4_SMD = smd 1.5 x 4.5: 1 1.905,-2.794; 2 0.635,2.794; 3 -0.635,-2.794; 4 -1.905,2.794
22-23-2031 = drill 1 long: 1 -2.54,0; 2 0,0; 3 2.54,0

### Placement (x,y rotation side)
AX12  5.08,66.65 270 top
C1  49.15,23.37 0 top  (outside the outline)
C2  80.9,46.99 180 top  (outside the outline)
C3  56.77,23.37 180 top  (outside the outline)
C4  49.53,57.15 0 top  (outside the outline)
C5  46.35,17.91 90 top  (outside the outline)
C6  52.96,23.37 180 top  (outside the outline)
C7  18.03,33.78 0 bottom
C8  23.5,37.85 90 bottom
C9  23.75,41.91 90 bottom
C10  12.95,42.8 90 bottom
C11  21.59,40.26 90 bottom
C12  22.48,33.15 0 bottom
C13  13.46,34.04 180 bottom
C14  21.84,44.7 0 bottom
C15  19.68,36.45 0 bottom
C16  5.97,35.94 90 bottom
C19  28.07,69.72 180 top
C20  24.51,69.85 0 top
C21  52.32,62.74 180 top  (outside the outline)
C22  16.76,44.83 0 bottom
C25  53.85,4.95 270 top  (outside the outline)
C26  47.88,4.83 270 top  (outside the outline)
C27  3.17,56.64 180 top
C28  6.73,56.64 0 top
C38  75.95,16.26 0 top  (outside the outline)
C39  83.95,21.97 180 top  (outside the outline)
C40  78.74,39.88 180 top  (outside the outline)
C41  66.17,39.62 0 top  (outside the outline)
C42  91.31,42.29 180 top  (outside the outline)
C43  89.66,63.12 180 top  (outside the outline)
C44  48.77,49.53 180 top  (outside the outline)
COM  2.41,40.89 90 top
D1  78.74,32.51 270 top  (outside the outline)
D2  80.52,55.37 270 top  (outside the outline)
D3  72.39,64.64 90 top  (outside the outline)
ERR  2.41,42.93 90 top
H1  95,75 0 top  (outside the outline)
H2  95,5 0 top  (outside the outline)
H3  4,76 0 top
H4  36,4 0 top
IC1  52.96,17.02 180 top  (outside the outline)
IC2  18.03,38.99 90 top
IC3  57.78,55.12 180 top  (outside the outline)
IC5  90.81,32.38 270 top  (outside the outline)
IC6  26.04,75.06 90 top
IC10  50.8,3.81 270 top  (outside the outline)
IC11  5.08,59.18 90 top
IC12  90.81,53.34 270 top  (outside the outline)
L1  69.98,27.69 270 top  (outside the outline)
L2  71.5,50.93 270 top  (outside the outline)
L_A0  2.41,38.86 90 top
L_A1  2.41,36.83 90 top
L_A2  2.41,34.92 90 top
L_A3  2.41,33.02 90 top
PDI_ATMEL  5.46,23.24 90 top
PW_BAT  5.21,4.45 270 top
PWMD0  34.92,59.82 180 top
PWMD1  34.92,63.37 180 top
PWMD2  34.92,66.93 180 top
PWMD3  34.92,70.61 180 top
PWMD4  34.92,74.17 180 top
PWMD5  34.92,77.6 180 top
R3  49.78,10.67 180 top  (outside the outline)
R4  47.12,12.06 270 top  (outside the outline)
R5  5.97,38.86 180 top
R6  5.97,36.83 180 top
R7  5.97,34.92 180 top
R8  5.97,33.02 180 top
R9  5.97,44.83 180 top
R10  5.97,42.93 180 top
R11  5.97,40.89 180 top
R12  81.92,27.81 270 top  (outside the outline)
R13  52.96,10.67 180 top  (outside the outline)
R14  56.13,10.67 180 top  (outside the outline)
R15  13.08,37.72 0 bottom
R17  2.03,59.05 270 top
R18  26.8,47.5 0 top
R19  26.8,49.15 0 top
R20  8.13,59.31 90 top
R24  79.5,50.55 270 top  (outside the outline)
R25  81.92,31.5 270 top  (outside the outline)
R27  81.92,50.16 270 top  (outside the outline)
RUN  2.41,44.83 90 top
UART  16,74.3 0 top
UART_CAM  3.56,50.8 270 top

### Tracks (layer width: path | path; a pad name or v marks a point on that pad's centre or on a via)
+3V3  (39 unrouted)
+5V  (19 unrouted)
+10V  (4 unrouted)
/RESET_3V3  (2 unrouted)
AX12_3V3  (3 unrouted)
AX12_5V  (2 unrouted)
AX12_DIR_3V3  (1 unrouted)
GND  (15 unrouted)
  pour Top (no thermals): -3.56,80.77 103.25,80.77 103.5,-1.4 -3.56,-1.4
  pour Bottom (no thermals): -5.33,80.77 101.47,80.77 101.47,-1.4 -5.33,-1.4
MISO_ENCODER_3V3  (1 unrouted)
N$1  (1 unrouted)
N$2  (1 unrouted)
N$3  (2 unrouted)
N$4  (1 unrouted)
N$5  (1 unrouted)
N$6  (1 unrouted)
N$7  (1 unrouted)
N$8  (2 unrouted)
N$9  (1 unrouted)
N$10  (1 unrouted)
N$11  (1 unrouted)
N$12  (1 unrouted)
N$13  (1 unrouted)
N$14  (2 unrouted)
N$16  (2 unrouted)
N$17  (2 unrouted)
N$24  (1 unrouted)
N$91  (1 unrouted)
N$92  (1 unrouted)
N$93  (1 unrouted)
N$94  (1 unrouted)
PA0  (1 unrouted)
PA1  (1 unrouted)
PA2  (1 unrouted)
PA3  (1 unrouted)
PDI_DATA_3V3  (1 unrouted)
PW  (4 unrouted)
PWM_D0_3V3  (1 unrouted)
PWM_D0_5V  (1 unrouted)
PWM_D1_3V3  (1 unrouted)
PWM_D1_5V  (1 unrouted)
PWM_D2_3V3  (1 unrouted)
PWM_D2_5V  (1 unrouted)
PWM_D3_3V3  (1 unrouted)
PWM_D3_5V  (1 unrouted)
PWM_D4_3V3  (1 unrouted)
PWM_D4_5V  (1 unrouted)
PWM_D5_3V3  (1 unrouted)
PWM_D5_5V  (1 unrouted)
RX_3V3  (3 unrouted)
RX_232  (2 unrouted)
RX_CAM_3V3  (2 unrouted)
TX_3V3  (4 unrouted)
TX_232  (2 unrouted)
TX_CAM_3V3  (2 unrouted)

### Text on the board
tPlace: meca 2014 / Rob'otter